# EAGLE design tpic8101_breakout (EAGLE 4.16)
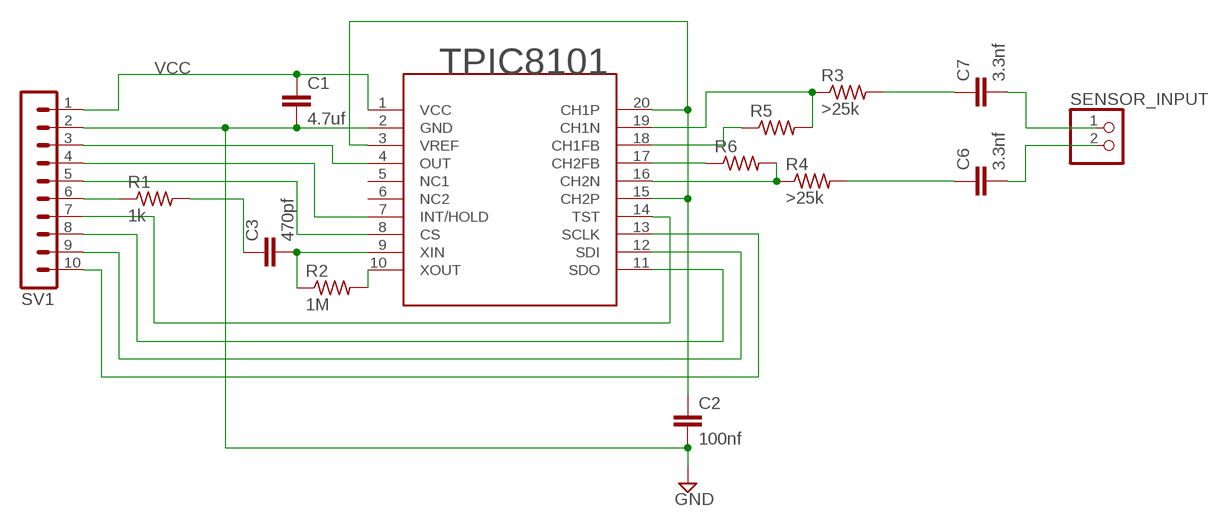
[diagram p0: schematic, sheet 1]

## Parts
C1  4.7uf  C5/2.5  [C5B2.5]
C2  100nf  C5/2.5  [C5B2.5]
C3  470pf  C5/2.5  [C5B2.5]
C6  3.3nf  C5/2.5  [C5B2.5]
C7  3.3nf  C5/2.5  [C5B2.5]
R1  1k  R-US_0309/10  [0309/10]
R2  1M  R-US_0309/10  [0309/10]
R3  >25k  R-US_0309/10  [0309/10]
R4  >25k  R-US_0309/10  [0309/10]
R5  R-US_0309/10  [0309/10]
R6  R-US_0309/10  [0309/10]
SENSOR_INPUT  PINHD-1X2  [1X02]
SV1  MA10-1  [MA10-1]
U$1  TPIC8101  [SO20L]

## Nets
GND: C1.2 C2.2 SV1.2 U$1.2(GND)
N$1: C2.1 U$1.3(VREF) U$1.15(CH2P) U$1.20(CH1P)
N$2: SV1.10 U$1.13(SCLK)
N$3: SV1.9 U$1.12(SDI)
N$4: SV1.8 U$1.11(SDO)
N$5: SV1.3 U$1.4(OUT)
N$6: SV1.4 U$1.7(INT/HOLD)
N$7: SV1.5 U$1.8(CS)
N$8: C3.1 R1.2
N$9: SV1.7 U$1.14(TST)
N$10: R1.1 SV1.6
N$11: C3.2 R2.1 U$1.9(XIN)
N$12: R2.2 U$1.10(XOUT)
N$13: R4.1 R6.2 U$1.16(CH2N)
N$14: R6.1 U$1.17(CH2FB)
N$15: R3.1 R5.2 U$1.19(CH1N)
N$16: R5.1 U$1.18(CH1FB)
N$17: C6.1 R4.2
N$18: C7.1 R3.2
N$19: C7.2 SENSOR_INPUT.1
N$20: C6.2 SENSOR_INPUT.2
VCC: C1.1 SV1.1 U$1.1(VCC)
Unconnected: U$1.5(NC1) U$1.6(NC2)

## Library data of the parts
C1-C3 C6 C7 = capacitor-wima:C: CAPACITOR naming: grid - package width
R1-R6 = rcl:R-US_: RESISTOR, American symbol
SENSOR_INPUT = pinhead:PINHD-1X2: PIN HEADER
SV1 = con-lstb:MA10-1: PIN HEADER
U$1 = tpic8101:TPIC8101

## Board
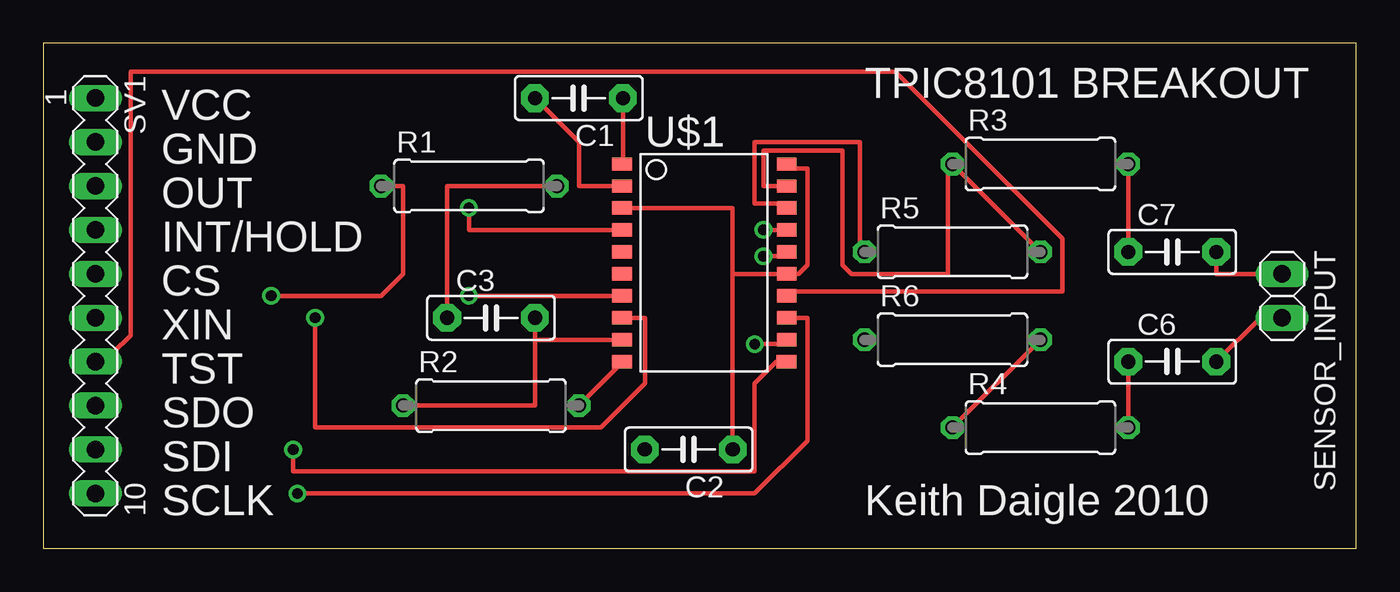
[diagram p1: board, top side]
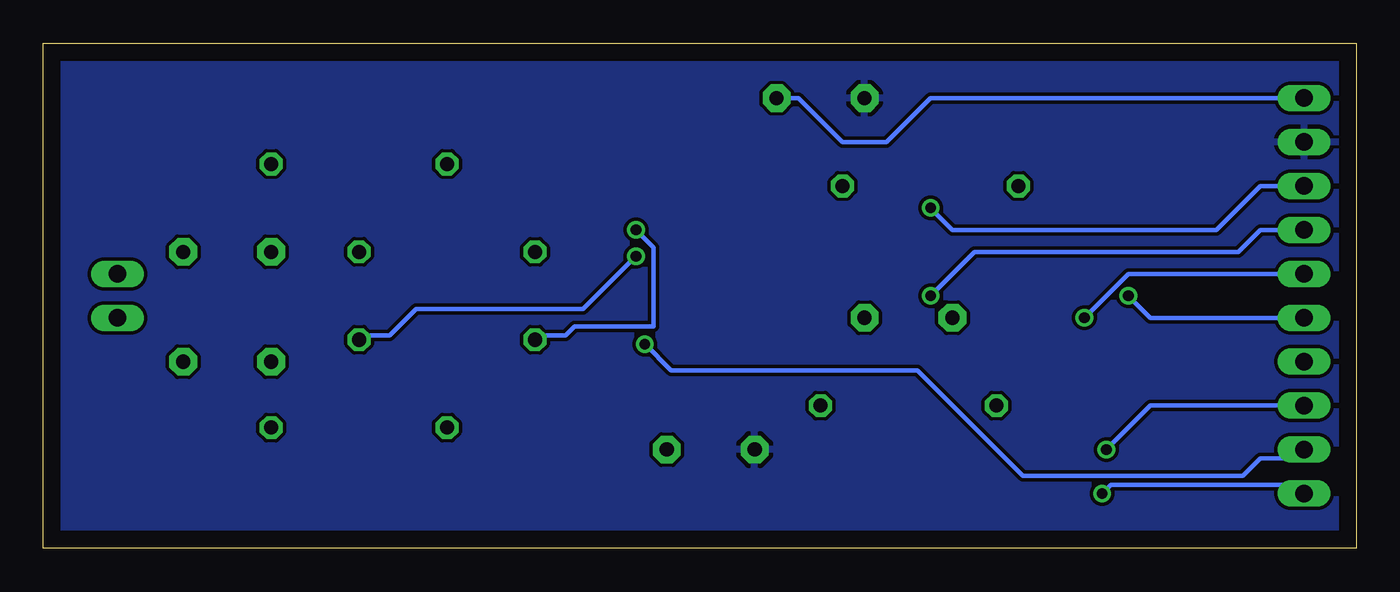
[diagram p2: board, bottom side, seen from below]

Size 75.87 x 29.2 mm. Coordinates in mm from the lower left corner, seen from the top.
Outline: 0,0 75.87,0 75.87,29.2 0,29.2 0,0
Copper layers (1*16): Top 0.035mm / dielectric 1.5mm / Bottom 0.035mm
Design rules "default": minimum track width 10mil, minimum drill 24mil, track to track 8mil, track to pad 8mil, pad to pad 8mil, via to via 8mil, smd to smd 8mil, copper to edge 40mil, drill to drill 8mil, minimum pad ring 10mil, minimum via ring 8mil, stop-mask expansion 4mil, vias tented up to drill 0mil, thermal gap 10mil

### Footprints (pad centres in the part's own frame; a part is rotated, then mirrored left to right if it is on the bottom)
C5B2.5 = drill 0.813 pad 1.6 octagon: 1 -2.54,0; 2 2.54,0
0309/10 = drill 0.813 octagon: 1 -5.08,0; 2 5.08,0
1X02 = drill 1.016 long: 1 -1.27,0; 2 1.27,0
MA10-1 = drill 1.016 long: 1 -11.43,0; 2 -8.89,0; 3 -6.35,0; 4 -3.81,0; 5 -1.27,0; 6 1.27,0; 7 3.81,0; 8 6.35,0; 9 8.89,0; 10 11.43,0
SO20L = smd 0.762 x 1.143: 1 -5.08,-5.131; 2 -3.81,-5.131; 3 -2.54,-5.131; 4 -1.27,-5.131; 5 0,-5.131; 6 1.27,-5.131; 7 2.54,-5.131; 8 3.81,-5.131; 9 5.08,-5.131; 10 6.35,-5.131; 11 6.35,4.369; 12 5.08,4.394; 13 3.81,4.394; 14 2.54,4.394; 15 1.27,4.394; 16 0,4.394; 17 -1.27,4.394; 18 -2.54,4.394; 19 -3.81,4.394; 20 -5.08,4.394

### Placement (x,y rotation side)
C1  30.95,26.03 180 top
C2  37.3,5.71 180 top
C3  25.87,13.33 0 top
C6  65.24,10.79 0 top
C7  65.24,17.14 0 top
R1  24.6,20.95 0 top
R2  25.87,8.25 0 top
R3  57.62,22.22 0 top
R4  57.62,6.98 0 top
R5  52.54,17.14 0 top
R6  52.54,12.06 0 top
SENSOR_INPUT  71.59,14.6 270 top
SV1  3.01,14.6 270 top
U$1  38.57,17.14 270 top

### Tracks (layer width: path | path; a pad name or v marks a point on that pad's centre or on a via)
GND
  Top 0.254: C1.2 30.95,23.49 30.95,20.95 U$1.2 33.49,20.95
  pour Bottom: 0.47,28.57 75.4,28.57 75.4,0.63 0.47,0.63
N$1
  Top 0.254: C2.1 39.84,15.87 | 39.84,15.87 39.84,19.68 U$1.3 | 39.84,15.87 U$1.15 43.65,15.87 44.16,16.38 44.16,21.97 43.14,21.97 U$1.20
N$2  (via drill 0.61)
  Top 0.254: v14.69,3.17 41.11,3.17 44.16,6.22 44.16,13.33 U$1.13
  Bottom 0.254: v14.69,3.17 14.19,3.68 4.03,3.68 SV1.10
N$3  (via drill 0.61)
  Top 0.254: v41.11,11.81 42.63,11.81 U$1.12
  Bottom 0.254: v41.11,11.81 39.59,10.28 25.36,10.28 19.27,4.19 6.57,4.19 5.55,5.2 4.03,5.2 SV1.9
N$4  (via drill 0.61)
  Top 0.254: v14.44,5.71 14.44,4.44 41.11,4.44 41.11,9.52 42.38,10.79 U$1.11
  Bottom 0.254: v14.44,5.71 11.9,8.25 SV1.8
N$5  (via drill 0.61)
  Top 0.254: v24.6,19.68 24.6,18.41 U$1.4 33.49,18.41
  Bottom 0.254: v24.6,19.68 23.33,18.41 8.09,18.41 5.55,20.95 SV1.3
N$6  (via drill 0.61)
  Top 0.254: v24.6,14.6 U$1.7 33.49,14.6
  Bottom 0.254: v24.6,14.6 22.06,17.14 6.82,17.14 5.55,18.41 SV1.4
N$7  (via drill 0.61)
  Top 0.254: v15.71,13.33 15.71,6.98 32.22,6.98 34.76,9.52 34.76,13.33 U$1.8
  Bottom 0.254: v15.71,13.33 13.17,15.87 SV1.5
N$8
  Top 0.254: R1.2 23.33,20.95 C3.1
N$9
  Top 0.254: U$1.14 43.14,14.85 58.89,14.85 58.89,17.9 49.24,27.55 5.04,27.55 5.04,12.31 4.03,11.3 SV1.7
N$10  (via drill 0.61)
  Top 0.254: R1.1 20.79,20.95 20.79,15.87 19.52,14.6 v13.17,14.6
  Bottom 0.254: v13.17,14.6 11.9,13.33 SV1.6
N$11
  Top 0.254: 28.41,12.06 U$1.9 33.49,12.06 | 28.41,12.06 C3.2 | R2.1 28.41,8.25 28.41,12.06
N$12
  Top 0.254: R2.2 33.49,10.79 U$1.10
N$13  (via drill 0.61)
  Top 0.254: R6.2 R4.1 | v41.62,16.89 42.63,16.89 U$1.16
  Bottom 0.254: v41.62,16.89 44.67,13.84 54.32,13.84 55.84,12.31 57.37,12.31 R6.2
N$14  (via drill 0.61)
  Top 0.254: v41.62,18.41 U$1.17
  Bottom 0.254: v41.62,18.41 40.6,17.39 40.6,12.82 45.17,12.82 45.68,12.31 47.21,12.31 R6.1
N$15
  Top 0.254: R5.2 R3.1 52.29,21.97 52.29,15.87 46.7,15.87 46.19,16.38 46.19,22.98 41.62,22.98 41.62,20.95 U$1.19
N$16
  Top 0.254: U$1.18 42.63,19.93 41.11,19.93 41.11,23.49 47.21,23.49 47.21,17.39 R5.1
N$17
  Top 0.254: R4.2 C6.1
N$18
  Top 0.254: C7.1 R3.2
N$19
  Top 0.254: C7.2 67.78,15.87 SENSOR_INPUT.1
N$20
  Top 0.254: C6.2 70.32,13.33 SENSOR_INPUT.2
VCC
  Top 0.254: C1.1 33.49,22.22 U$1.1
  Bottom 0.254: C1.1 32.22,26.03 29.68,23.49 27.14,23.49 24.6,26.03 SV1.1

### Text on the board
tNames: TPIC8101 BREAKOUT | VCC | GND | OUT | INT/HOLD | CS | XIN | TST | SDO | SDI | SCLK | Keith Daigle 2010